# EAGLE design pcb-bldc-servo-2 (EAGLE 9.6.2)
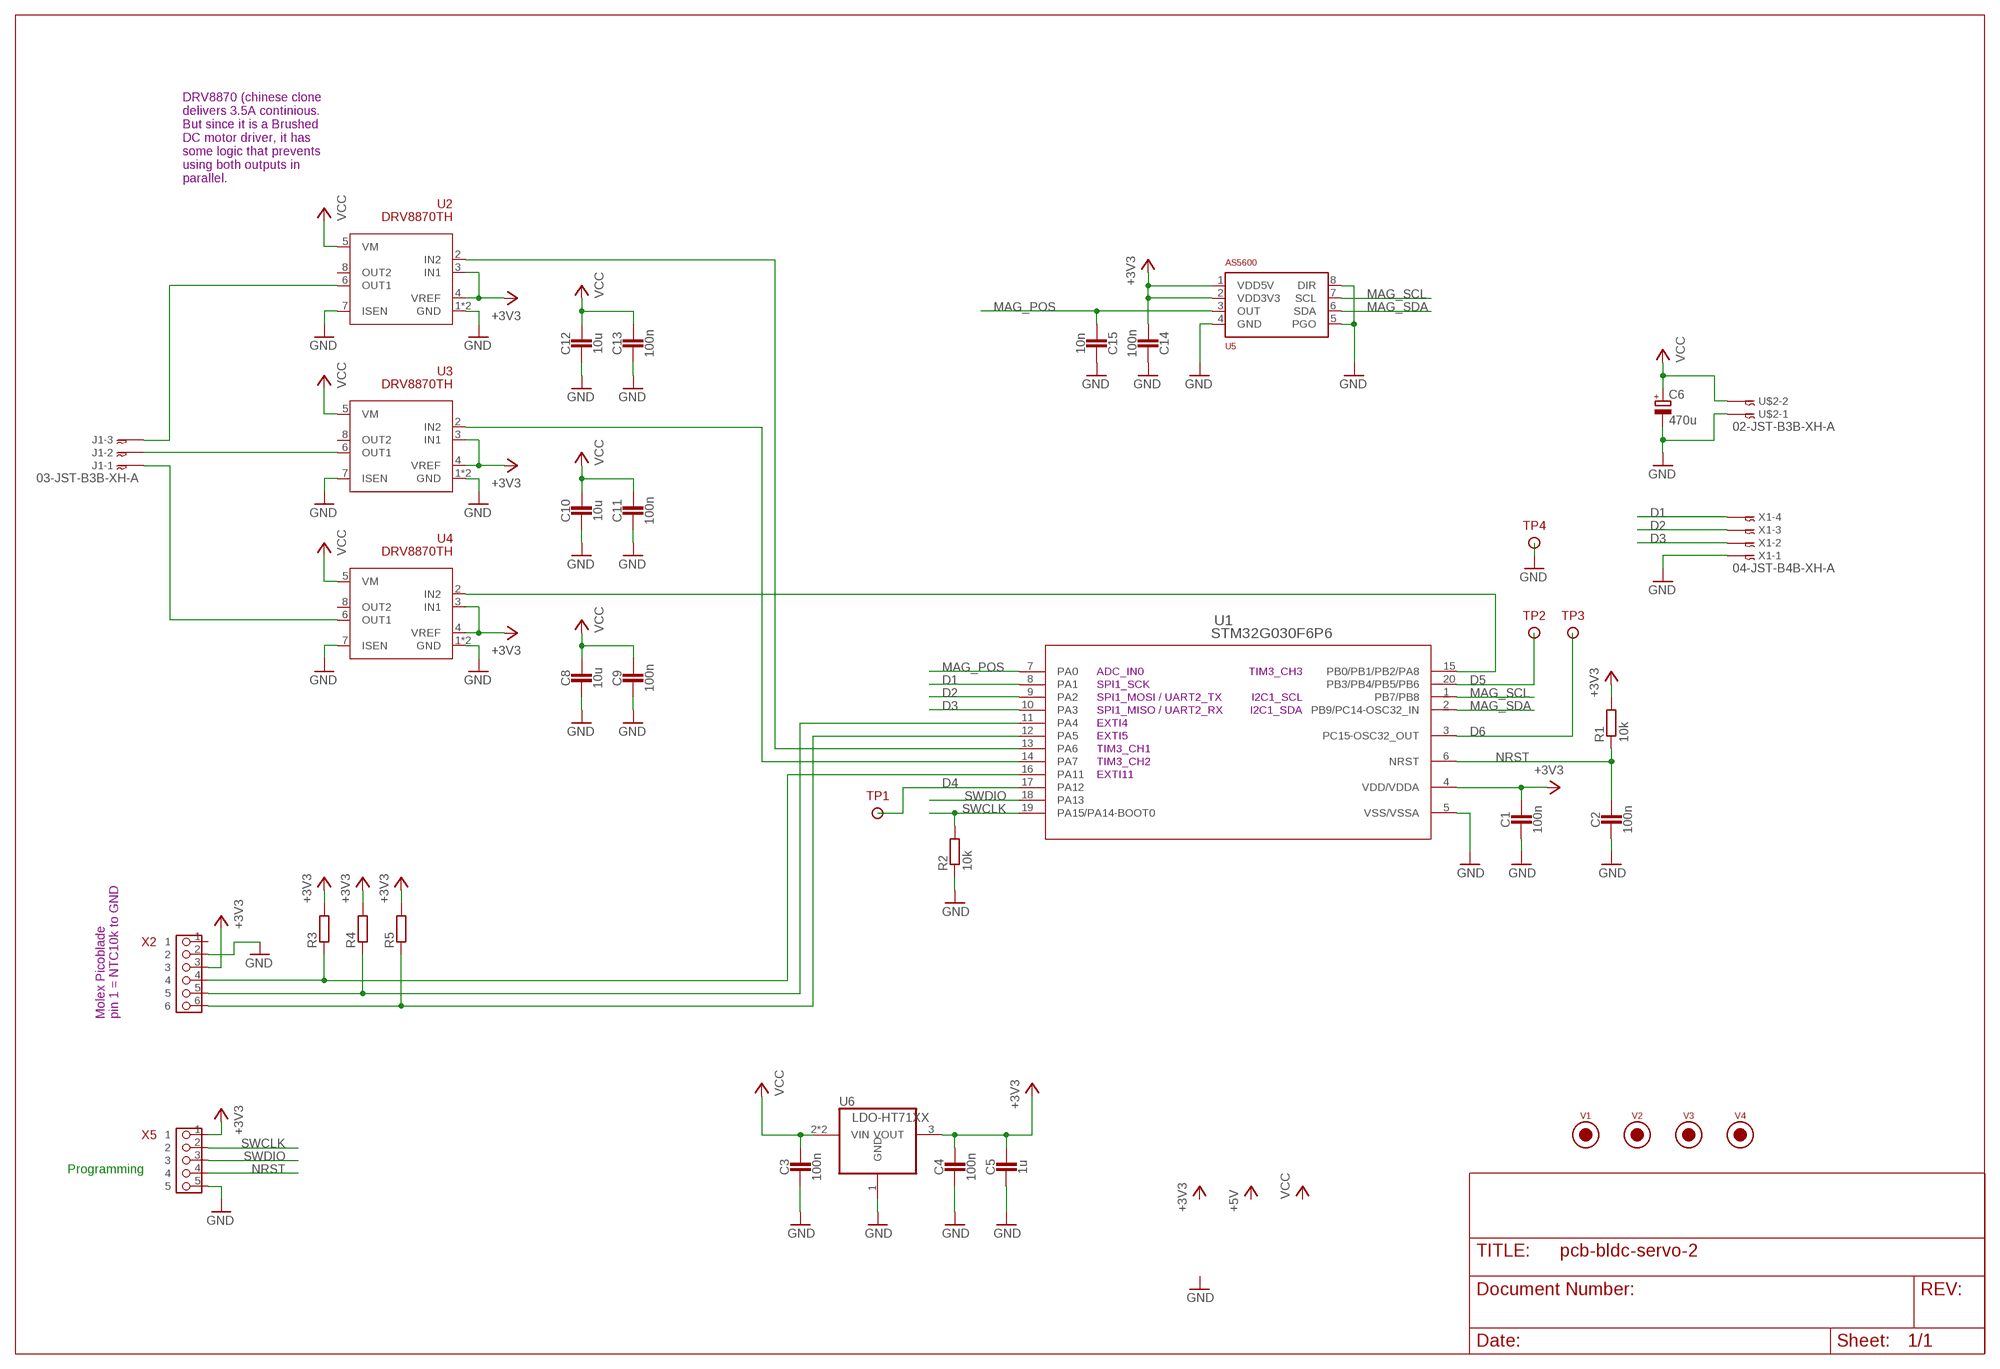
[diagram p0: schematic, sheet 1]

## Parts
C1  100n  CAPACITOR0603_CAP  [0603_CAP]
C2  100n  CAPACITOR0603_CAP  [0603_CAP]
C3  100n  CAPACITOR0603_CAP  [0603_CAP]
C4  100n  CAPACITOR0603_CAP  [0603_CAP]
C5  1u  CAPACITOR0603_CAP  [0603_CAP]
C6  470u  CPOL-EU153CLV-1010  [153CLV-1010]
C8  10u  CAPACITOR1206_CAP  [1206_CAP]
C9  100n  CAPACITOR0603_CAP  [0603_CAP]
C10  10u  CAPACITOR1206_CAP  [1206_CAP]
C11  100n  CAPACITOR0603_CAP  [0603_CAP]
C12  10u  CAPACITOR1206_CAP  [1206_CAP]
C13  100n  CAPACITOR0603_CAP  [0603_CAP]
C14  100n  CAPACITOR0603_CAP  [0603_CAP]
C15  10n  CAPACITOR0603_CAP  [0603_CAP]
J1  03-JST-B3B-XH-A  [B3B-XH]
R1  10k  RESISTOR0603_RES  [0603-RES]
R2  10k  RESISTOR0603_RES  [0603-RES]
R3  RESISTOR0603_RES  [0603-RES]
R4  RESISTOR0603_RES  [0603-RES]
R5  RESISTOR0603_RES  [0603-RES]
TP1  TESTPIN1MM  [PIN-SMD-1X1-TEST_1M0]
TP2  TESTPIN1MM  [PIN-SMD-1X1-TEST_1M0]
TP3  TESTPIN1MM  [PIN-SMD-1X1-TEST_1M0]
TP4  TESTPIN1MM  [PIN-SMD-1X1-TEST_1M0]
U1  STM32G030F6P6  [TSSOP20]
U2  DRV8870TH  [SOIC-8-THERM]
U3  DRV8870TH  [SOIC-8-THERM]
U4  DRV8870TH  [SOIC-8-THERM]
U5  AS5600  [SOIC-8]
U6  LDO-HT71XX  [SOT-89]
U$2  02-JST-B3B-XH-A  [B2B-XH]
V1  FIDUCIAL2MM  [FIDUCIAL_2MM]
V2  FIDUCIAL2MM  [FIDUCIAL_2MM]
V3  FIDUCIAL2MM  [FIDUCIAL_2MM]
V4  FIDUCIAL2MM  [FIDUCIAL_2MM]
X1  04-JST-B4B-XH-A  [B4B-XH]
X2  PIN_6X1  [PIN_6X1_MOLEX_PICOBLADE]
X5  PIN_5X1HD  [PIN_5X1_HD]

## Nets
+3V3: C1.1 C4.1 C5.1 C14.1 R1.2 R3.2 R4.2 R5.2 U1.4(VDD/VDDA) U2.3(IN1) U2.4(VREF) U3.3(IN1) U3.4(VREF) U4.3(IN1) U4.4(VREF) U5.1(VDD5V) U5.2(VDD3V3) U6.3(VOUT) X2.3 X5.1
D1: U1.8(PA1) X1.P$4
D2: U1.9(PA2) X1.P$3
D3: U1.10(PA3) X1.P$2
D4: TP1.1 U1.17(PA12)
D5: TP2.1 U1.20(PB3/PB4/PB5/PB6)
D6: TP3.1 U1.3(PC15-OSC32_OUT)
GND: C1.2 C2.2 C3.2 C4.2 C5.2 C6.- C8.2 C9.2 C10.2 C11.2 C12.2 C13.2 C14.2 C15.2 R2.1 TP4.1 U1.5(VSS/VSSA) U2.1(GND) U2.7(ISEN) U2.9(GND) U3.1(GND) U3.7(ISEN) U3.9(GND) U4.1(GND) U4.7(ISEN) U4.9(GND) U5.4(GND) U5.5(PGO) U5.8(DIR) U6.1(GND) U$2.P$1 X1.P$1 X2.2 X5.5
MAG_POS: C15.1 U1.7(PA0) U5.3(OUT)
MAG_SCL: U1.1(PB7/PB8) U5.7(SCL)
MAG_SDA: U1.2(PB9/PC14-OSC32_IN) U5.6(SDA)
N$3: J1.P$2 U3.6(OUT1)
N$4: J1.P$3 U2.6(OUT1)
N$5: U1.13(PA6) U2.2(IN2)
N$6: U1.14(PA7) U3.2(IN2)
N$7: J1.P$1 U4.6(OUT1)
N$9: U1.15(PB0/PB1/PB2/PA8) U4.2(IN2)
N$24: R5.1 U1.12(PA5) X2.6
N$25: R4.1 U1.11(PA4) X2.5
N$28: R3.1 U1.16(PA11) X2.4
NRST: C2.1 R1.1 U1.6(NRST) X5.4
SWCLK: R2.2 U1.19(PA15/PA14-BOOT0) X5.2
SWDIO: U1.18(PA13) X5.3
VCC: C3.1 C6.+ C8.1 C9.1 C10.1 C11.1 C12.1 C13.1 U2.5(VM) U3.5(VM) U4.5(VM) U6.2(VIN) U6.2@1(VIN) U$2.P$2
Unconnected: U2.8(OUT2) U3.8(OUT2) U4.8(OUT2) X2.1

## Notes on the sheet
- DRV8870 (chinese clone
  delivers 3.5A continious.
  But since it is a Brushed
  DC motor driver, it has
  some logic that prevents
  using both outputs in 
  parallel.
- ADC_IN0 | TIM3_CH3
- SPI1_SCK
- SPI1_MOSI / UART2_TX | I2C1_SCL
- SPI1_MISO / UART2_RX | I2C1_SDA
- EXTI4
- EXTI5
- TIM3_CH1
- TIM3_CH2
- EXTI11
- Molex Picoblade
  pin 1 = NTC10k to GND
- Programming

## Library data of the parts
C1-C5 C8-C15 = passives:CAPACITOR: SMD Capacitor
C6 = resistor:CPOL-EU: POLARIZED CAPACITOR, European symbol
J1 = bt_con-jst-xh:03-JST: JST CONNECTOR
R1-R5 = passives:RESISTOR: Resistor Basic schematic elements and footprints for 0201, 0402, 0603, 1206, and PTH resistors.
TP1-TP4 = ftobler_backup:TESTPIN
U1 = stm32:STM32G030F6P6; COPYRIGHT: Copyright (C) 2024 Ultra Librarian. All rights reserved.; MANUFACTURER_PART_NUMBER: STM32G030F6P6; MFR_NAME: STMicroelectronics
U2-U4 = ftobler:DRV8870
U5 = ftobler:AS5600
U6 = ftobler:LDO
U$2 = bt_con-jst-xh:02-JST: JST CONNECTOR
V1-V4 = ftobler - Copy:FIDUCIAL
X1 = bt_con-jst-xh:04-JST: JST CONNECTOR
X2 = ftobler-conn:PIN_6X1
X5 = ftobler-conn:PIN_5X1

## Board
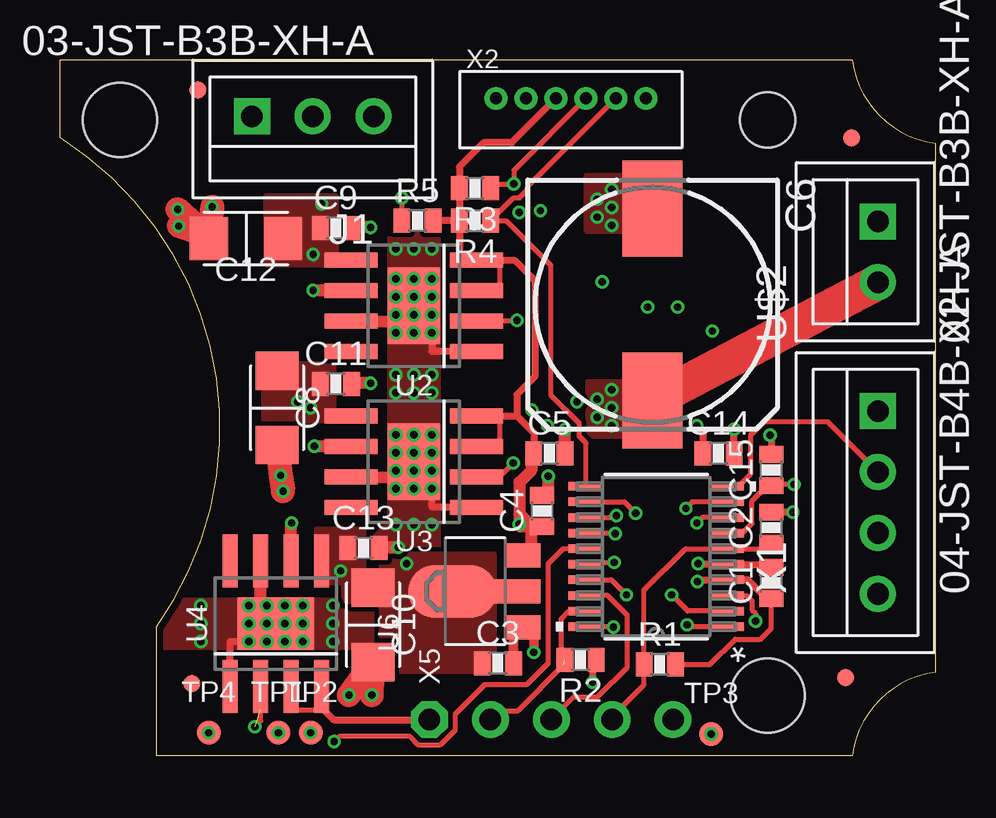
[diagram p1: board, top side]
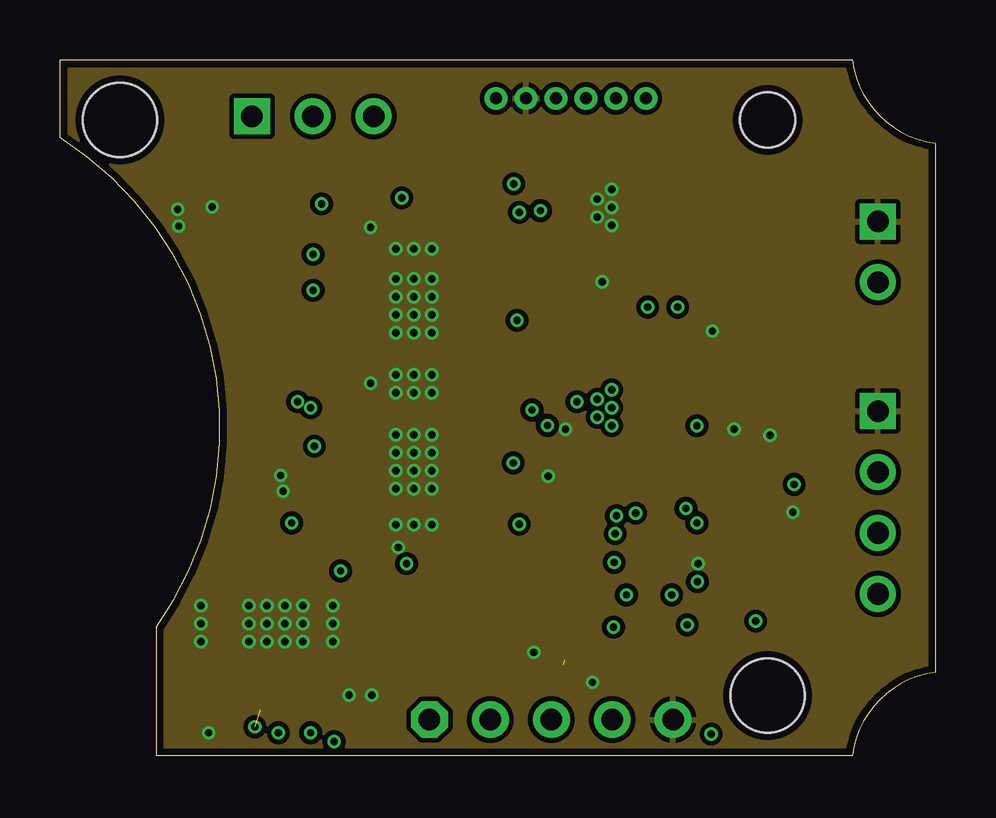
[diagram p2: board, inner layer Route2]
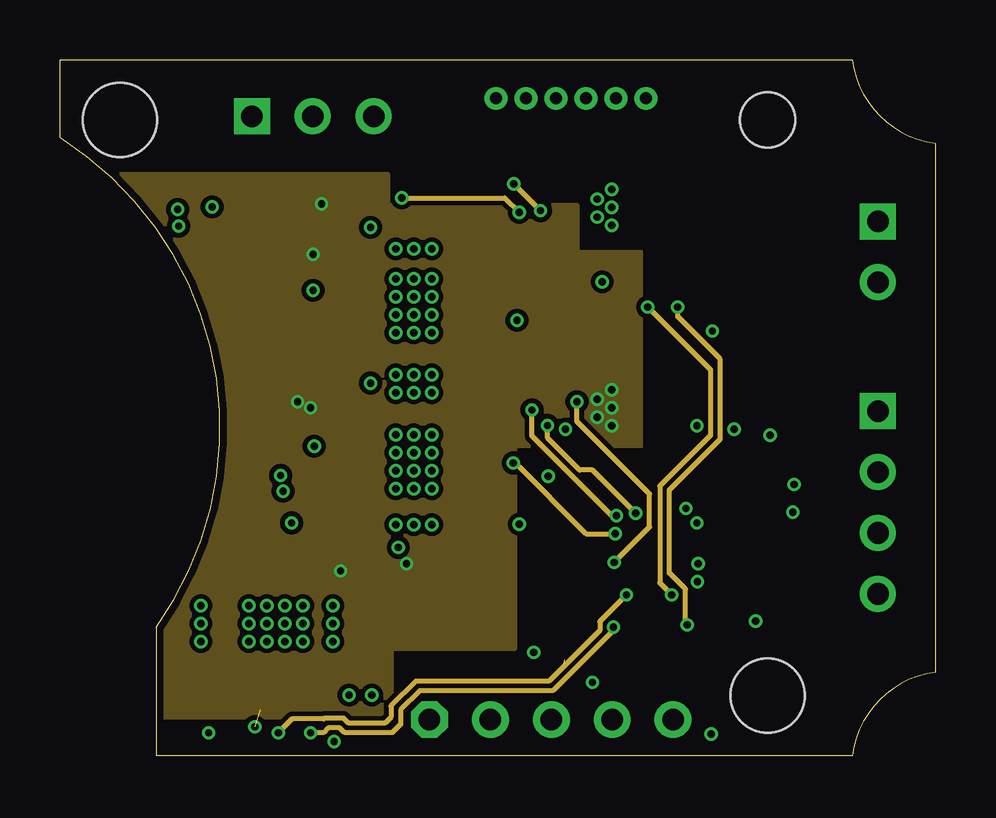
[diagram p3: board, inner layer Route15]
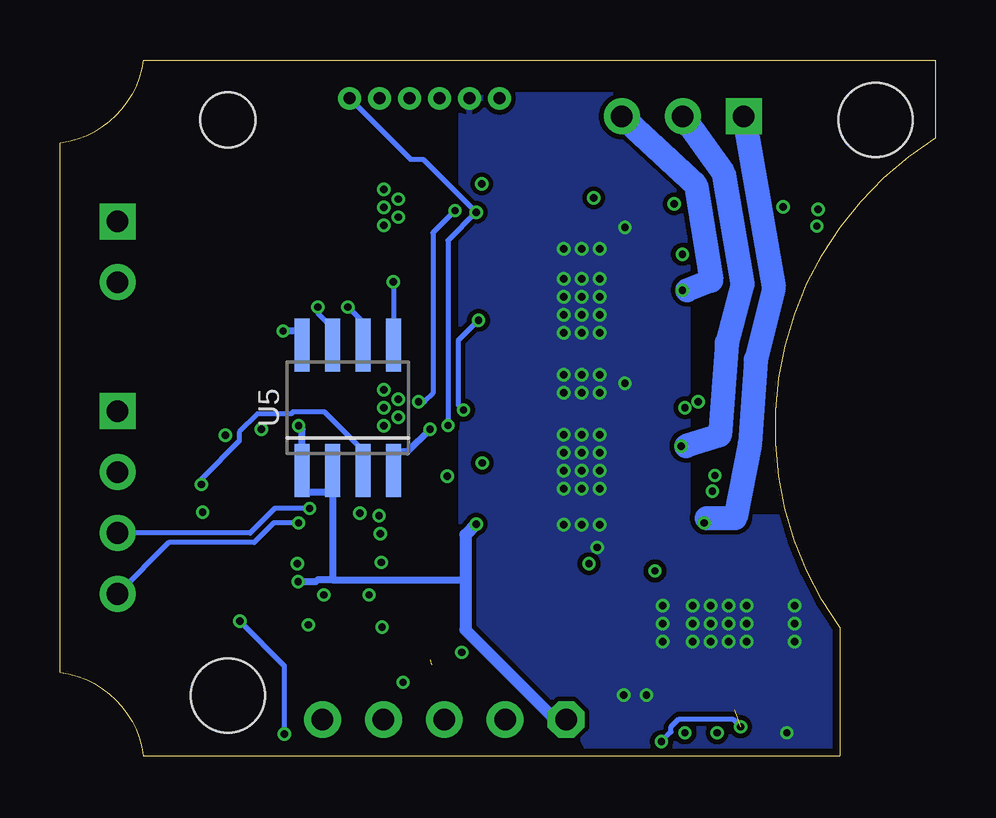
[diagram p4: board, bottom side, seen from below]

Size 36.5 x 29 mm. Coordinates in mm from the lower left corner, seen from the top.
Outline: 36.5,3.47 arc76 33.03,0 4,0 4,5.34 arc93 0,25.76 0,29 33.03,29 arc76 36.5,25.53 36.5,3.47
Copper layers (1+2*15+16): Top 0.035mm / dielectric 0.2mm / Route2 0.035mm / dielectric 0.4mm / Route15 0.035mm / dielectric 0.2mm / Bottom 0.035mm
Design rules "default *": minimum track width 0.15mm, minimum drill 0.2mm, track to track 0.2mm, track to pad 0.2mm, pad to pad 0.15mm, via to via 0.2mm, smd to smd 0.2mm, copper to edge 0.3mm, drill to drill 10mil, minimum pad ring 0.125mm, minimum via ring 0.125mm, stop-mask expansion 0.05mm, vias tented up to drill 0.35mm, thermal gap 0.2mm
Holes 3.1 mm at 2.5,26.5 29.5,2.5
Holes 2.3 mm at 29.5,26.5
tRestrict: area 0.5,24.5 to 4.5,28.5; area 27.5,24.5 to 31.5,28.5; area 27.5,0.5 to 31.5,4.5
bRestrict: area 0.5,24.5 to 4.5,28.5; area 27.5,24.5 to 31.5,28.5; area 27.5,0.5 to 31.5,4.5; 1 lines

### Footprints (pad centres in the part's own frame; a part is rotated, then mirrored left to right if it is on the bottom)
0603_CAP = smd 0.7 x 1: 1 -0.65,0; 2 0.65,0
153CLV-1010 = smd 4 x 2.5: + 4,0; - -4,0
1206_CAP = smd 1.6 x 1.8: 1 -1.55,0; 2 1.55,0
B3B-XH = drill 0.9 pad 1.5 square: P$1 2.54,0 | drill 0.9 pad 1.5: P$2 0,0; P$3 -2.54,0
0603-RES = smd 0.7 x 1: 1 -0.65,0; 2 0.65,0
PIN-SMD-1X1-TEST_1M0 = smd 1 x 1: 1 0,0
TSSOP20 = smd 1.462 x 0.355: 1 -2.921,2.925; 2 -2.921,2.275; 3 -2.921,1.625; 4 -2.921,0.975; 5 -2.921,0.325; 6 -2.921,-0.325; 7 -2.921,-0.975; 8 -2.921,-1.625; 9 -2.921,-2.275; 10 -2.921,-2.925; 11 2.921,-2.925; 12 2.921,-2.275; 13 2.921,-1.625; 14 2.921,-0.975; 15 2.921,-0.325; 16 2.921,0.325; 17 2.921,0.975; 18 2.921,1.625; 19 2.921,2.275; 20 2.921,2.925
SOIC-8-THERM = smd 0.61 x 2.21: 1 -1.905,-2.616; 2 -0.635,-2.616; 3 0.635,-2.616; 4 1.905,-2.616; 5 1.905,2.616; 6 0.635,2.616; 7 -0.635,2.616; 8 -1.905,2.616 | smd 3.2 x 2.2: 9 0,0
SOIC-8 = smd 0.61 x 2.21: 1 -1.905,-2.616; 2 -0.635,-2.616; 3 0.635,-2.616; 4 1.905,-2.616; 5 1.905,2.616; 6 0.635,2.616; 7 -0.635,2.616; 8 -1.905,2.616
SOT-89 = smd 1 x 1.5: 1 -1.499,-1.981; 3 1.499,-1.981 | smd 1 x 2: 2 0,-1.727 | smd 2.2 x 3.7: 2@1 0,0.94
B2B-XH = drill 0.9 pad 1.5 square: P$1 1.27,0 | drill 0.9 pad 1.5: P$2 -1.27,0
FIDUCIAL_2MM = smd 0.7 x 0.7: V 0,0
B4B-XH = drill 0.9 pad 1.5 square: P$1 3.81,0 | drill 0.9 pad 1.5: P$2 1.27,0; P$3 -1.27,0; P$4 -3.81,0
PIN_6X1_MOLEX_PICOBLADE = drill 0.5 pad 0.95: 1 -3.125,0; 2 -1.875,0; 3 -0.625,0; 4 0.625,0; 5 1.875,0; 6 3.125,0
PIN_5X1_HD = drill 0.9 pad 1.54 octagon: 1 0,0 | drill 0.9 pad 1.54: 2 0,-2.54; 3 0,-5.08; 4 0,-7.62; 5 0,-10.16

### Placement (x,y rotation side)
C1  29.65,7.2 90 top
C2  29.65,9.5 90 top
C3  18.25,3.85 0 top
C4  20.1,10.2 90 top
C5  20.4,12.6 0 top
C6  24.7,18.8 270 top
C8  9.05,14.5 270 top
C9  11.5,22 0 top
C10  13.05,5.45 270 top
C11  11.5,15.5 0 top
C12  7.75,21.55 180 top
C13  12.65,8.65 0 top
C14  27.45,12.6 0 top
C15  29.65,11.9 90 top
J1  10.54,26.65 180 top
R1  25,3.8 0 top
R2  21.7,4 180 top
R3  17.3,23.65 180 top
R4  17.3,22.3 180 top
R5  14.9,22.3 0 top
TP1  9.1,0.95 0 top
TP2  10.45,0.95 0 top
TP3  27.15,0.9 0 top
TP4  6.2,0.95 0 top
U1  24.85,8.3 180 top
U2  14.75,18.75 90 top
U3  14.75,12.25 90 top
U4  9,5.5 0 top
U5  24.5,14.5 0 bottom
U6  17.3,6.85 90 top
U$2  34.1,21 90 top
V1  5.75,27.75 0 top
V2  33,25.75 0 top
V3  32.75,3.25 0 top
V4  5.5,3 0 top
X1  34.1,10.55 90 top
X2  21.3,27.4 0 top
X5  15.4,1.5 90 top

### Tracks (layer width: path | path; a pad name or v marks a point on that pad's centre or on a via)
+3V3  (via drill 0.3 pad 0.45)
  Top 0.2: R1.2 27.1,3.8 28.15,4.85 29.2,4.85 29.65,5.3 C1.1 | U3.3 18.35,12.88 18.35,14.15 | U2.3 17.38,19.4 18.35,19.4 18.35,20.55 18.25,20.66 | U4.3 9.7,2.82 9.7,1.9 10.81,1.9 10.9,2
  Top 0.3: X2.3 18.82,25.55 17.65,25.55 16.65,24.55 R3.2 R4.2 | R4.2 R5.2 | R4.2 16.65,20.65 U2.4 18.25,20.66 18.95,20.66 19.8,19.8 19.8,15.8 19.05,15.04 19.05,14.15 | U4.4 10.9,2 11.4,1.5 X5.1 | 18.2,14.15 U3.4 18.35,14.15 19.05,14.15 | C5.1 19.75,13.45 19.05,14.15 | C1.1 29.45,6.55 28.68,7.33 U1.4 26.65,7.33 v26.58,7.25 | v26.55,13.75 26.8,13.5 C14.1 | v19.15,9.65 19.2,9.6 19.2,9.55
  Top 0.5: 19.72,9.49 19.85,9.62 20.02,9.44 20.1,9.52 C4.1 19.2,9.55 19.15,9.6 19.15,10.06 | 19.72,9.49 19.63,9.4 19.63,8.7 U6.3 | C5.1 19.65,12.5 19.65,11.89 19.15,11.39 19.15,10.06 | 19.72,9.49 19.15,10.06
  Bottom 0.3: v26.55,13.75 26.41,13.61 U5.1 26.41,11.01 26.4,11 25.22,11 25.14,11.09 | 25.14,11.09 U5.2 25.14,7.34 25.15,7.33 | 25.14,11.09 25.05,11 | v26.58,7.25 25.83,7.25 25.76,7.33 25.15,7.33 | 19.6,7.35 19.62,7.33 25.15,7.33
  Bottom 0.5: X5.1 15.85,1.5 19.6,5.25 19.6,7.35 19.6,9.2 v19.15,9.65
D1  (via drill 0.3 pad 0.45)
  Top 0.2: U1.8 26.77,9.93 v26.55,9.7
  Bottom 0.2: v26.55,9.7 27.58,9.7 28.4,8.88 31.96,8.88 X1.P$4
D2  (via drill 0.3 pad 0.45)
  Top 0.2: U1.9 26.36,10.57 v26.09,10.3
  Bottom 0.2: v26.09,10.3 27.55,10.3 28.57,9.28 X1.P$3
D3
  Top 0.2: U1.10 28.27,11.22 28.8,11.75 28.8,13.36 29.36,13.93 32,13.93 X1.P$2
D4  (via drill 0.3 pad 0.45)
  Top 0.2: U1.17 22.99,7.33 v23.61,6.7
  Route15 0.2: v23.61,6.7 22.84,5.92 22.5,5.59 22.5,5.22 20.38,3.1 14.83,3.1 13.8,2.07 13.8,1.6 13.55,1.35 12.03,1.35 11.83,1.55 11.02,1.55 10.99,1.52 9.68,1.52 TP1.1
  other vias: 9.1,0.95
D5  (via drill 0.3 pad 0.45)
  Top 0.2: U1.20 23.05,5.38 v23.07,5.35
  Route15 0.2: v23.07,5.35 23.07,5.22 20.55,2.7 15,2.7 14.2,1.9 14.2,1.3 13.85,0.95 11.87,0.95 11.66,1.16 11.19,1.16 10.98,0.95 TP2.1
  other vias: 10.45,0.95
D6  (via drill 0.3 pad 0.45)
  Top 0.2: U1.3 28.62,6.67 28.85,6.45 28.85,6.08 29,5.93 v29,5.6
  Bottom 0.2: v29,5.6 27.15,3.75 TP3.1
  other vias: 27.15,0.9
GND  (via drill 0.3 pad 0.45)
  Top 0.3: U2.1 15.5,16.84 v15.5,17.62 | U3.1 15.53,10.35 15.5,10.38 v15.5,11.12 | U4.1 7.09,4.75 v7.88,4.75 | R2.1 22.2,3.85 v22.2,3.05 | 21.05,13.57 v21.07,13.6 | C14.2 v28.1,13.6 | v29.6,13.35 29.65,13.3 C15.2 | C2.2 v30.55,10.15 | C1.2 29.52,7.97 U1.5 26.62,7.97 v26.6,8
  Top 0.4: v19.75,4.3 19.75,4.88 U6.1 19.05,5.35 18.9,5.2 C3.2
  Top 0.5: U3.7 14.05,11.6 | U4.7 8.35,6.2 | U2.7 14,18.1 | v14.1,8.68 13.3,8.68 C13.2 | v12.95,15.53 12.15,15.53 C11.2 | v12.95,22.02 12.15,22.02 C9.2 | C5.2 21.05,13.57 | C4.2 20.35,11.1 v20.35,11.65
  Top 1: C8.2 v9.2,11.68 v9.3,11.03 | v4.9,22.77 5.65,22.1 C12.2 | C12.2 6.05,21.7 v4.95,22.07 | v6.35,22.88 C12.2 | v12.05,2.52 C10.2 v13,2.52
  Route15 0.2: TP4.1 6.25,0.95
  Bottom 0.2: v22.6,19.75 U5.5
  Bottom 0.3: U5.5 | v27.2,17.7 26.5,17.7 26.41,17.61 U5.8 | v21.07,13.6 22.02,12.65 22.5,12.65 22.59,12.55 U5.4
  other vias: 14,19.88 14.75,19.88 15.5,19.88 15.5,19.12 15.5,18.38 14.75,17.62 14.75,18.38 14.75,19.12 14,19.12 14,18.38 14,17.62 14,13.38 14.75,13.38 15.5,13.38 15.5,12.62 14.75,12.62 14,12.62 14,11.88 14.75,11.88 15.5,11.88 14.75,11.12 14,11.12 7.88,5.5 7.88,6.25 8.62,6.25 8.62,5.5 8.62,4.75 9.38,4.75 9.38,5.5 9.38,6.25 10.12,6.25 10.12,5.5 10.12,4.75 23,23.6 23,22.85 23,22.1 22.4,22.45 22.4,23.2 14,21.12 14.75,21.12 15.5,21.12 14,15.88 14.75,15.88 15.5,15.88 14,15.12 14.75,15.12 15.5,15.12 5.88,4.75 5.88,5.5 5.88,6.25 11.38,4.75 11.38,5.5 11.38,6.25 14,9.62 14.75,9.62 15.5,9.62 6.2,0.95
  pour Route2: -2,31 39,31 39,-2 -2,-2 arc1
  pour Bottom: 10.3,27.55 19.8,27.55 19.8,4.9 10.3,4.9
  pour Bottom: 4.25,-0.3 4.25,9.95 19,9.95 19,-0.3
  pour Top (no thermals): 21.95,24.2 24.9,24.2 24.9,21.85 21.95,21.85
  pour Top (rank 2, no thermals): 3.5,6.5 13.25,6.5 13.25,4.5 3.5,4.5
  pour Top (rank 2, no thermals): 13.75,8.5 13.75,21.75 15.75,21.75 15.75,8.5
  pour Top (rank 2, no thermals): 13,9 14,10 14.5,10 14.5,8.5 13,8.5
MAG_POS  (via drill 0.3 pad 0.45)
  Top 0.2: U1.7 28.45,9.28 28.85,9.67 28.85,10.62 29.43,11.2 29.43,11.25 C15.1 29.7,11.3 v30.6,11.3
  Bottom 0.2: U5.3 23.86,12.71 25.48,14.32 26.79,14.32 26.86,14.25 28.26,14.25 29.02,13.49 29.02,13.11 30.6,11.54 v30.6,11.3
MAG_SCL  (via drill 0.3 pad 0.45)
  Top 0.2: U1.1 26.23,5.38 v26.15,5.45
  Route15 0.2: v26.15,5.45 26.07,5.53 26.07,6.94 25.4,7.61 25.4,11.07 27.52,13.2 27.52,16.52 25.75,18.3 v25.75,18.7
  Bottom 0.2: v25.75,18.7 25.75,18.43 25.14,17.82 U5.7
MAG_SDA  (via drill 0.3 pad 0.45)
  Top 0.2: U1.2 26.18,6.03 v25.5,6.7
  Route15 0.2: v25.5,6.7 25,7.2 25,11.24 27.12,13.36 27.12,16.07 v24.5,18.7
  Bottom 0.2: v24.5,18.7 23.86,18.07 U5.6
N$3  (via drill 0.3 pad 0.45)
  Top 0.5: U3.6 10.62,12.88 v10.6,12.9
  Bottom 0.5: v10.6,12.9 10.4,12.9
  Bottom 1: J1.P$2 8.85,24.3 8.05,19.65 8.7,17.2 9,13.35 10.4,12.9
N$4  (via drill 0.3 pad 0.45)
  Top 0.5: U2.6 10.56,19.39 v10.55,19.4
  Bottom 0.5: v10.55,19.4 10.35,19.4
  Bottom 1: J1.P$3 10,23.8 9.35,19.8 10.35,19.4
N$5  (via drill 0.3 pad 0.45)
  Top 0.2: 18.35,18.15 18.32,18.11 | 18.32,18.11 18.14,18.11 U2.2 | U1.13 23.12,9.93 v23.2,10 | v19.05,18.15 19.02,18.11 18.32,18.11
  Route15 0.2: v23.2,10 23,10 19.68,13.32 v19.68,14.41
  Bottom 0.2: v19.68,14.41 19.9,14.63 19.9,17.3 v19.05,18.15
N$6  (via drill 0.3 pad 0.45)
  Top 0.2: 18.35,11.6 17.38,11.6 U3.2 18.32,11.62 v18.9,12.2 | U1.14 23.12,9.28 v23.15,9.25
  Route15 0.2: v18.9,12.2 18.99,12.2 21.94,9.25 v23.15,9.25
N$7  (via drill 0.3 pad 0.45)
  Top 0.5: 9.63,8.87 U4.6 9.63,9.69 v9.65,9.7
  Bottom 0.5: v9.65,9.7 9.55,9.9
  Bottom 1: J1.P$1 6.75,19.5 7.5,16.5 7.75,13 8.35,9.9 9.55,9.9
N$9  (via drill 0.3 pad 0.45)  (1 unrouted)
  Top 0.2: 8.37,1.92 8.37,1.9 | U1.15 20.98,8.62 20.35,8 20.35,3.85 19.45,2.95 17.7,2.95 16.47,1.72 16.47,1.06 15.84,0.43 14.96,0.43 14.59,0.8 11.64,0.8 v11.43,0.58 | v8.12,1.2 8.37,1.44 U4.2
  Bottom 0.2: v11.43,0.58 11.03,0.98 11.03,1.19 10.69,1.52 8.45,1.52 v8.12,1.2
N$24  (via drill 0.3 pad 0.45)
  Top 0.2: 14.25,22.52 R5.1 v14.25,23.25 | U1.12 23.52,10.57 v24,10.1
  Route15 0.2: v14.25,23.25 18.55,23.25 v19.15,22.65 | v24,10.1 22.2,11.9 21.67,11.9 20.32,13.24 v20.32,13.76
  Bottom 0.2: X2.6 21.89,24.86 21.36,24.86 v19.15,22.65 20.32,21.48 v20.32,13.76
N$25
  Top 0.2: U1.11 21.93,13.02 21.65,13.3 21.65,13.84 20.45,15.04 20.45,20.45 18.6,22.3 R4.1 18.91,23.26 19.16,23.26 19.49,23.59 19.49,23.72 X2.5
N$28  (via drill 0.3 pad 0.45)
  Top 0.2: X2.4 18.92,24.39 v18.92,23.83 18.13,23.83 R3.1 | U1.16 22,8.05 v23.1,8.05
  Route15 0.2: v18.92,23.83 v20.03,22.72 | v21.55,14.75 21.55,13.94 24.57,10.91 24.57,9.53 v23.1,8.05
  Bottom 0.2: v20.03,22.72 20.95,21.8 20.95,15.1 21.3,14.75 v21.55,14.75
NRST
  Top 0.2: X5.4 23.02,1.62 24.35,2.95 R1.1 24.35,6.9 26.07,8.62 U1.6 29.43,8.62 C2.1
SWCLK  (1 unrouted)
  Top 0.2: 21.91,6 U1.19 21.23,6.03 20.9,5.7 20.9,4.15 R2.2 | X5.2 18.29,1.85 19.07,1.85 21,3.78
SWDIO
  Top 0.2: U1.18 22.82,6.67 23.65,5.85 23.65,3.69 22.41,2.45 21.43,2.45 X5.3
VCC  (via drill 0.3 pad 0.45)
  Top 1.5: C6.+ U$2.P$2
  other vias: 10.55,20.9 10.9,23 9.9,14.75 10.45,14.5 14.45,8 11.7,7.7 23,15.25 23,14.5 23,13.75 22.4,14.1 22.4,14.85
  pour Top (no thermals): 10.7,9.45 12.65,9.45 12.65,7.55 13.7,7.55 13.7,6.4 11.85,6.4 11.85,7.2 10.7,7.2
  pour Top (no thermals): 13.4,8.4 18.1,8.4 18.1,3.5 13.4,3.5
  pour Top (no thermals): 8.6,23.35 11.5,23.35 11.5,20.85 12.55,20.85 12.55,20.45 8.6,20.45
  pour Top (no thermals): 8.5,16.35 11.4,16.35 11.4,14.35 12.45,14.35 12.45,13.95 8.5,13.95
  pour Top (no thermals): 22,15.6 25.4,15.6 25.4,13.3 22,13.3
  pour Route15: 1.4,24.25 13.65,24.25 13.65,22.95 21.55,22.95 21.55,21 24.2,21 24.2,12.9 18.95,12.9 18.95,4.45 13.8,4.45 13.8,1.6 1.4,1.6

### Text on the board
tStop: V2 | V1 | V4 | V3 | GND | D4 | D5 | D6
tFinish: JLCJLCJLCJLC | 3 | C | D | R | G
bFinish: W | V | U | G | + | C | B | A | GND | VCC | GND | D3 | D2 | pcb-bldc-servo v2 / by ftobler 2024 | D1 | 3 | C | D | R | G